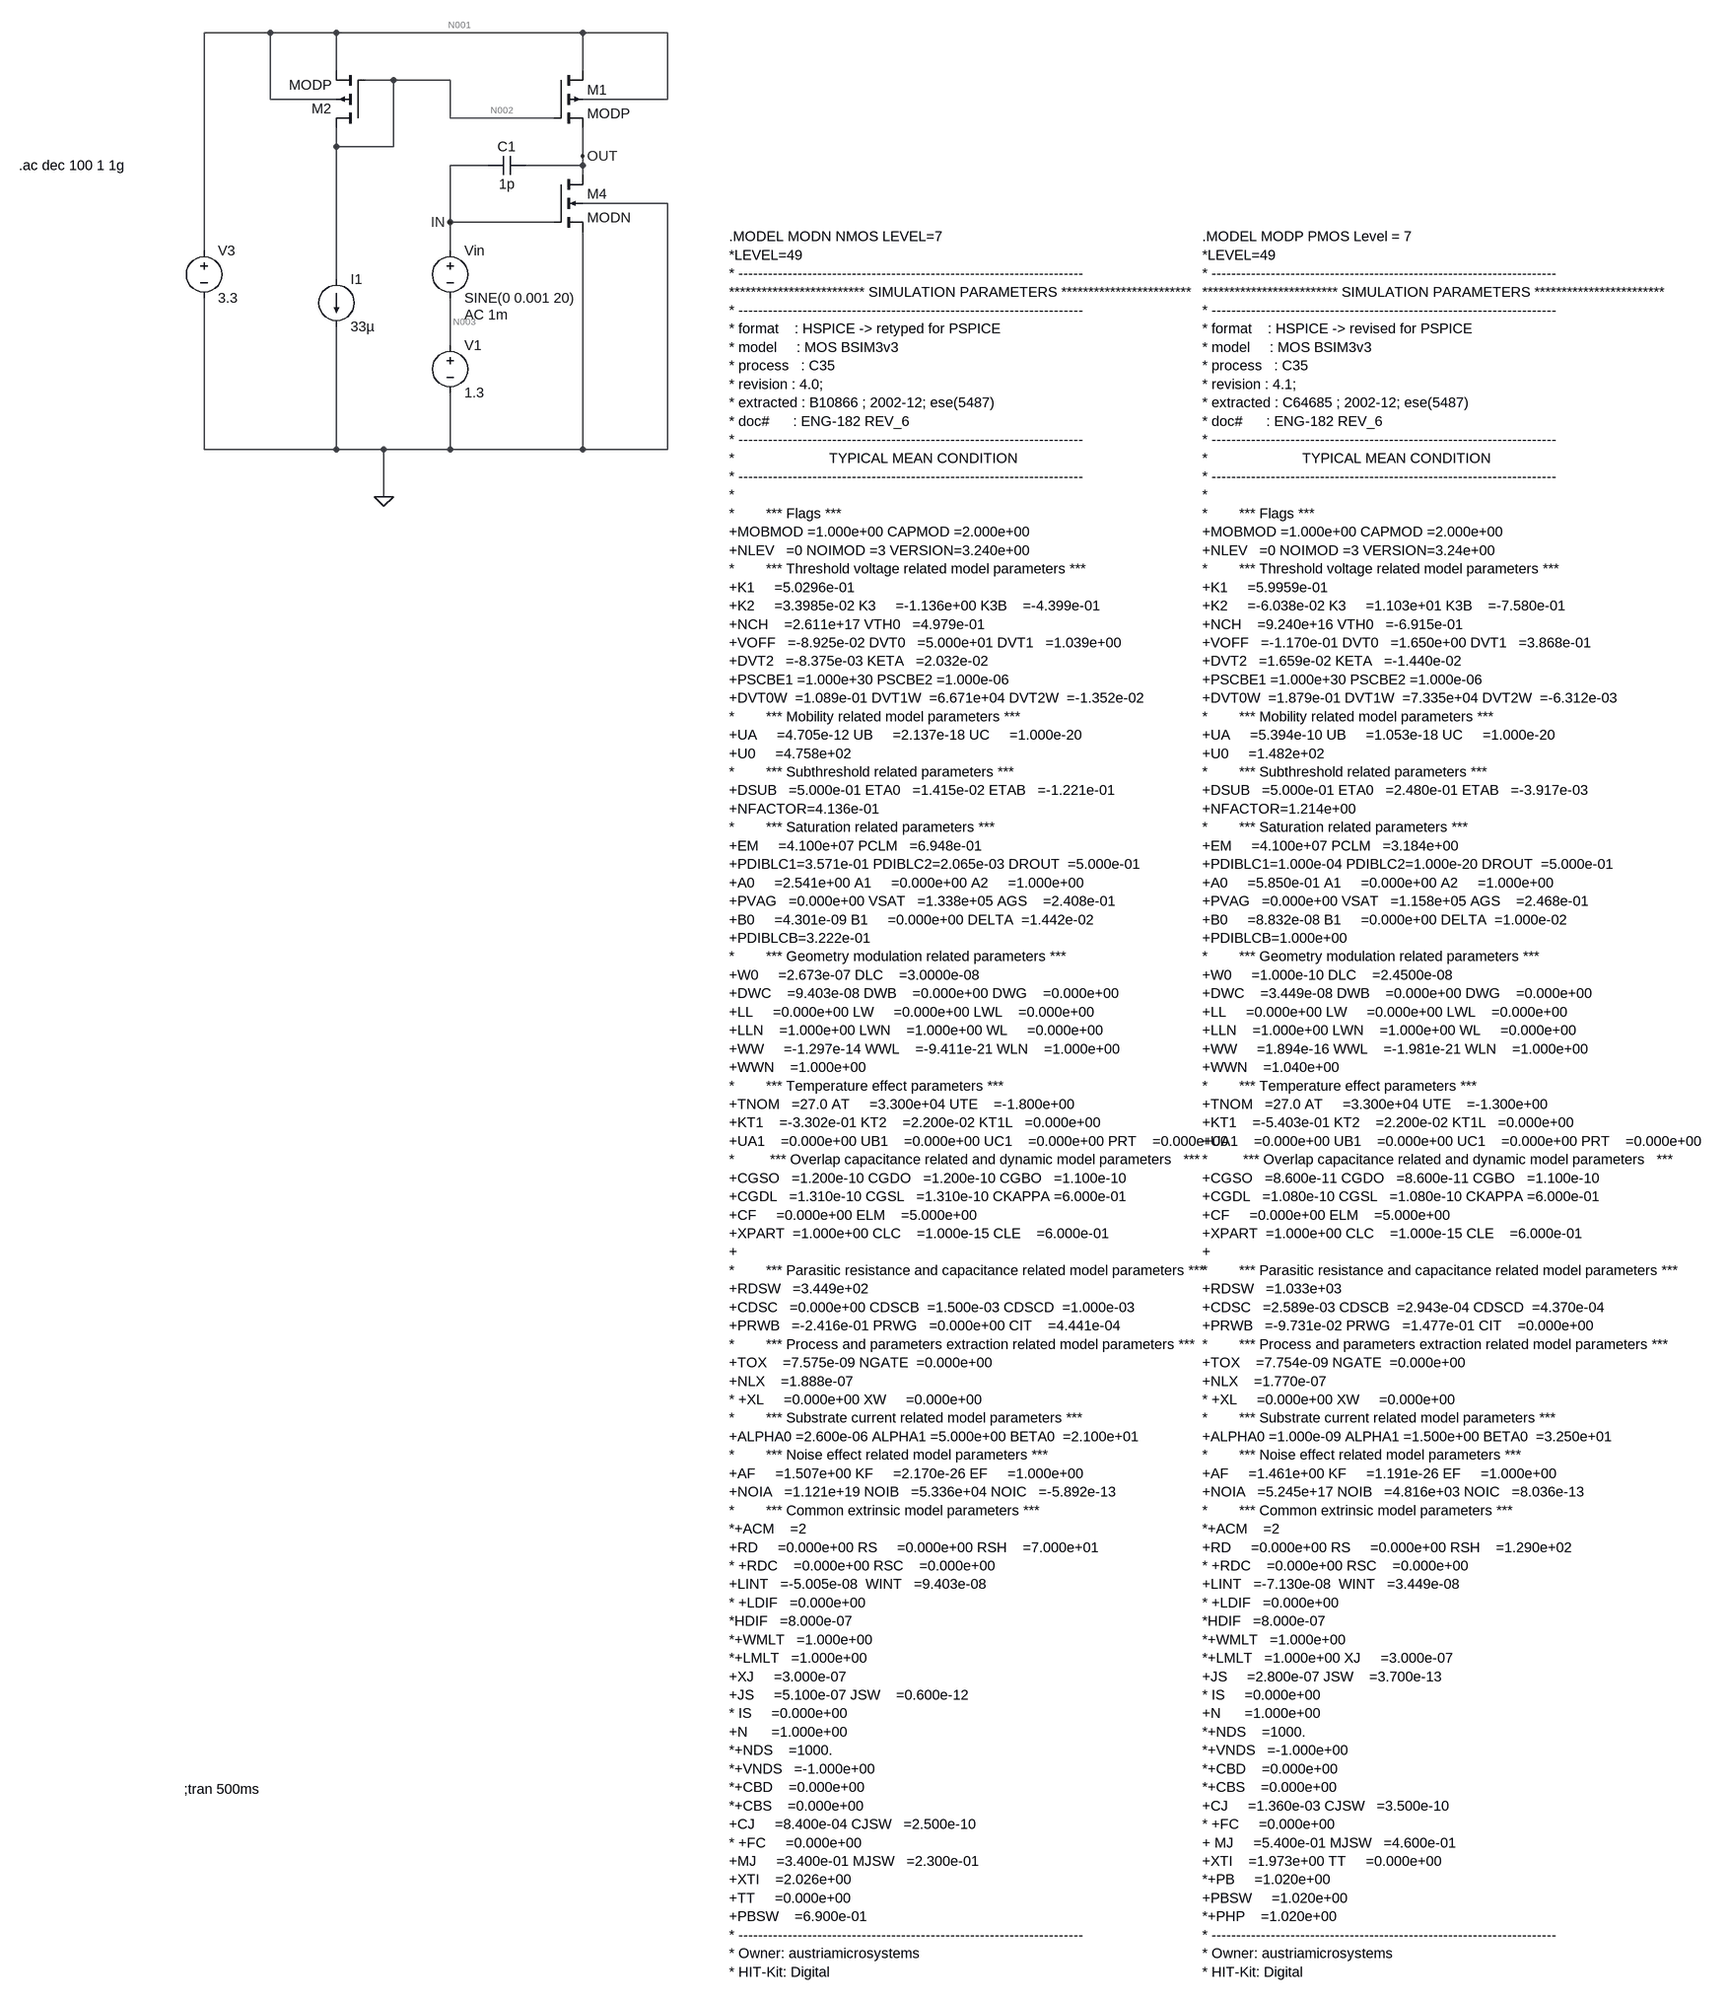
[diagram p0: schematic CS.asc]
CS.asc, the LTspice schematic file:
Version 4
SHEET 1 1960 2832
WIRE -464 -160 -576 -160
WIRE -352 -160 -464 -160
WIRE 64 -160 -352 -160
WIRE 208 -160 64 -160
WIRE -352 -96 -352 -160
WIRE 64 -96 64 -160
WIRE -256 -80 -304 -80
WIRE -160 -80 -256 -80
WIRE -464 -48 -464 -160
WIRE -352 -48 -464 -48
WIRE 208 -48 208 -160
WIRE 208 -48 64 -48
WIRE -160 -16 -160 -80
WIRE 16 -16 -160 -16
WIRE -352 32 -352 0
WIRE -256 32 -256 -80
WIRE -256 32 -352 32
WIRE 64 48 64 0
WIRE -96 64 -160 64
WIRE 64 64 64 48
WIRE 64 64 -32 64
WIRE 64 80 64 64
WIRE 208 128 64 128
WIRE -160 160 -160 64
WIRE 16 160 -160 160
WIRE -576 208 -576 -160
WIRE -160 208 -160 160
WIRE -352 256 -352 32
WIRE -160 368 -160 288
WIRE -576 544 -576 288
WIRE -352 544 -352 336
WIRE -352 544 -576 544
WIRE -272 544 -352 544
WIRE -160 544 -160 448
WIRE -160 544 -272 544
WIRE 64 544 64 176
WIRE 64 544 -160 544
WIRE 208 544 208 128
WIRE 208 544 64 544
WIRE -272 624 -272 544
FLAG -272 624 0
FLAG 64 48 OUT
FLAG -160 160 IN
SYMBOL voltage -160 352 R0
WINDOW 123 0 0 Left 2
WINDOW 39 0 0 Left 2
SYMATTR InstName V1
SYMATTR Value 1.3
SYMBOL voltage -160 192 R0
WINDOW 123 24 124 Left 2
WINDOW 39 0 0 Left 2
SYMATTR InstName Vin
SYMATTR Value SINE(0 0.001 20)
SYMATTR Value2 AC 1m
SYMBOL current -352 256 R0
WINDOW 123 0 0 Left 2
WINDOW 39 0 0 Left 2
SYMATTR InstName I1
SYMATTR Value 33µ
SYMBOL voltage -576 192 R0
WINDOW 123 0 0 Left 2
WINDOW 39 0 0 Left 2
SYMATTR InstName V3
SYMATTR Value 3.3
SYMBOL nmos4 16 80 R0
SYMATTR InstName M4
SYMATTR Value MODN
SYMATTR Value2 l=1.4u w=1.4u
SYMBOL pmos4 16 -96 R0
SYMATTR InstName M1
SYMATTR Value MODP
SYMATTR Value2 l=1.4u w=1.4u
SYMBOL pmos4 -304 0 R180
SYMATTR InstName M2
SYMATTR Value MODP
SYMATTR Value2 l=1.4u w=1.4u
SYMBOL cap -32 48 R90
WINDOW 0 0 32 VBottom 2
WINDOW 3 32 32 VTop 2
SYMATTR InstName C1
SYMATTR Value 1p
TEXT 312 184 Left 2 !.MODEL MODN NMOS LEVEL=7\n*LEVEL=49 \n* ----------------------------------------------------------------------\n************************* SIMULATION PARAMETERS ************************\n* ----------------------------------------------------------------------\n* format    : HSPICE -> retyped for PSPICE\n* model     : MOS BSIM3v3\n* process   : C35\n* revision : 4.0; \n* extracted : B10866 ; 2002-12; ese(5487)\n* doc#      : ENG-182 REV_6\n* ----------------------------------------------------------------------\n*                        TYPICAL MEAN CONDITION\n* ----------------------------------------------------------------------\n*\n*        *** Flags ***\n+MOBMOD =1.000e+00 CAPMOD =2.000e+00 \n+NLEV   =0 NOIMOD =3 VERSION=3.240e+00 \n*        *** Threshold voltage related model parameters ***\n+K1     =5.0296e-01 \n+K2     =3.3985e-02 K3     =-1.136e+00 K3B    =-4.399e-01 \n+NCH    =2.611e+17 VTH0   =4.979e-01 \n+VOFF   =-8.925e-02 DVT0   =5.000e+01 DVT1   =1.039e+00 \n+DVT2   =-8.375e-03 KETA   =2.032e-02 \n+PSCBE1 =1.000e+30 PSCBE2 =1.000e-06 \n+DVT0W  =1.089e-01 DVT1W  =6.671e+04 DVT2W  =-1.352e-02 \n*        *** Mobility related model parameters ***\n+UA     =4.705e-12 UB     =2.137e-18 UC     =1.000e-20 \n+U0     =4.758e+02 \n*        *** Subthreshold related parameters ***\n+DSUB   =5.000e-01 ETA0   =1.415e-02 ETAB   =-1.221e-01 \n+NFACTOR=4.136e-01 \n*        *** Saturation related parameters ***\n+EM     =4.100e+07 PCLM   =6.948e-01 \n+PDIBLC1=3.571e-01 PDIBLC2=2.065e-03 DROUT  =5.000e-01 \n+A0     =2.541e+00 A1     =0.000e+00 A2     =1.000e+00 \n+PVAG   =0.000e+00 VSAT   =1.338e+05 AGS    =2.408e-01 \n+B0     =4.301e-09 B1     =0.000e+00 DELTA  =1.442e-02 \n+PDIBLCB=3.222e-01 \n*        *** Geometry modulation related parameters ***\n+W0     =2.673e-07 DLC    =3.0000e-08 \n+DWC    =9.403e-08 DWB    =0.000e+00 DWG    =0.000e+00 \n+LL     =0.000e+00 LW     =0.000e+00 LWL    =0.000e+00 \n+LLN    =1.000e+00 LWN    =1.000e+00 WL     =0.000e+00 \n+WW     =-1.297e-14 WWL    =-9.411e-21 WLN    =1.000e+00 \n+WWN    =1.000e+00 \n*        *** Temperature effect parameters ***\n+TNOM   =27.0 AT     =3.300e+04 UTE    =-1.800e+00 \n+KT1    =-3.302e-01 KT2    =2.200e-02 KT1L   =0.000e+00 \n+UA1    =0.000e+00 UB1    =0.000e+00 UC1    =0.000e+00 PRT    =0.000e+00 \n*         *** Overlap capacitance related and dynamic model parameters   ***\n+CGSO   =1.200e-10 CGDO   =1.200e-10 CGBO   =1.100e-10 \n+CGDL   =1.310e-10 CGSL   =1.310e-10 CKAPPA =6.000e-01 \n+CF     =0.000e+00 ELM    =5.000e+00 \n+XPART  =1.000e+00 CLC    =1.000e-15 CLE    =6.000e-01 \n+\n*        *** Parasitic resistance and capacitance related model parameters ***\n+RDSW   =3.449e+02 \n+CDSC   =0.000e+00 CDSCB  =1.500e-03 CDSCD  =1.000e-03 \n+PRWB   =-2.416e-01 PRWG   =0.000e+00 CIT    =4.441e-04 \n*        *** Process and parameters extraction related model parameters ***\n+TOX    =7.575e-09 NGATE  =0.000e+00 \n+NLX    =1.888e-07 \n* +XL     =0.000e+00 XW     =0.000e+00 \n*        *** Substrate current related model parameters ***\n+ALPHA0 =2.600e-06 ALPHA1 =5.000e+00 BETA0  =2.100e+01 \n*        *** Noise effect related model parameters ***\n+AF     =1.507e+00 KF     =2.170e-26 EF     =1.000e+00 \n+NOIA   =1.121e+19 NOIB   =5.336e+04 NOIC   =-5.892e-13 \n*        *** Common extrinsic model parameters ***\n*+ACM    =2        \n+RD     =0.000e+00 RS     =0.000e+00 RSH    =7.000e+01 \n* +RDC    =0.000e+00 RSC    =0.000e+00 \n+LINT   =-5.005e-08  WINT   =9.403e-08 \n* +LDIF   =0.000e+00 \n*HDIF   =8.000e-07\n*+WMLT   =1.000e+00 \n*+LMLT   =1.000e+00 \n+XJ     =3.000e-07 \n+JS     =5.100e-07 JSW    =0.600e-12 \n* IS     =0.000e+00 \n+N      =1.000e+00 \n*+NDS    =1000. \n*+VNDS   =-1.000e+00 \n*+CBD    =0.000e+00 \n*+CBS    =0.000e+00 \n+CJ     =8.400e-04 CJSW   =2.500e-10 \n* +FC     =0.000e+00 \n+MJ     =3.400e-01 MJSW   =2.300e-01 \n+XTI    =2.026e+00 \n+TT     =0.000e+00 \n+PBSW    =6.900e-01 \n* ----------------------------------------------------------------------\n* Owner: austriamicrosystems\n* HIT-Kit: Digital
TEXT 1112 184 Left 2 !.MODEL MODP PMOS Level = 7\n*LEVEL=49 \n* ----------------------------------------------------------------------\n************************* SIMULATION PARAMETERS ************************\n* ----------------------------------------------------------------------\n* format    : HSPICE -> revised for PSPICE\n* model     : MOS BSIM3v3\n* process   : C35\n* revision : 4.1; \n* extracted : C64685 ; 2002-12; ese(5487)\n* doc#      : ENG-182 REV_6\n* ----------------------------------------------------------------------\n*                        TYPICAL MEAN CONDITION\n* ----------------------------------------------------------------------\n*\n*        *** Flags ***\n+MOBMOD =1.000e+00 CAPMOD =2.000e+00 \n+NLEV   =0 NOIMOD =3 VERSION=3.24e+00 \n*        *** Threshold voltage related model parameters ***\n+K1     =5.9959e-01 \n+K2     =-6.038e-02 K3     =1.103e+01 K3B    =-7.580e-01 \n+NCH    =9.240e+16 VTH0   =-6.915e-01 \n+VOFF   =-1.170e-01 DVT0   =1.650e+00 DVT1   =3.868e-01 \n+DVT2   =1.659e-02 KETA   =-1.440e-02 \n+PSCBE1 =1.000e+30 PSCBE2 =1.000e-06 \n+DVT0W  =1.879e-01 DVT1W  =7.335e+04 DVT2W  =-6.312e-03 \n*        *** Mobility related model parameters ***\n+UA     =5.394e-10 UB     =1.053e-18 UC     =1.000e-20 \n+U0     =1.482e+02 \n*        *** Subthreshold related parameters ***\n+DSUB   =5.000e-01 ETA0   =2.480e-01 ETAB   =-3.917e-03 \n+NFACTOR=1.214e+00 \n*        *** Saturation related parameters ***\n+EM     =4.100e+07 PCLM   =3.184e+00 \n+PDIBLC1=1.000e-04 PDIBLC2=1.000e-20 DROUT  =5.000e-01 \n+A0     =5.850e-01 A1     =0.000e+00 A2     =1.000e+00 \n+PVAG   =0.000e+00 VSAT   =1.158e+05 AGS    =2.468e-01 \n+B0     =8.832e-08 B1     =0.000e+00 DELTA  =1.000e-02 \n+PDIBLCB=1.000e+00 \n*        *** Geometry modulation related parameters ***\n+W0     =1.000e-10 DLC    =2.4500e-08 \n+DWC    =3.449e-08 DWB    =0.000e+00 DWG    =0.000e+00 \n+LL     =0.000e+00 LW     =0.000e+00 LWL    =0.000e+00 \n+LLN    =1.000e+00 LWN    =1.000e+00 WL     =0.000e+00 \n+WW     =1.894e-16 WWL    =-1.981e-21 WLN    =1.000e+00 \n+WWN    =1.040e+00 \n*        *** Temperature effect parameters ***\n+TNOM   =27.0 AT     =3.300e+04 UTE    =-1.300e+00 \n+KT1    =-5.403e-01 KT2    =2.200e-02 KT1L   =0.000e+00 \n+UA1    =0.000e+00 UB1    =0.000e+00 UC1    =0.000e+00 PRT    =0.000e+00 \n*         *** Overlap capacitance related and dynamic model parameters   ***\n+CGSO   =8.600e-11 CGDO   =8.600e-11 CGBO   =1.100e-10 \n+CGDL   =1.080e-10 CGSL   =1.080e-10 CKAPPA =6.000e-01 \n+CF     =0.000e+00 ELM    =5.000e+00 \n+XPART  =1.000e+00 CLC    =1.000e-15 CLE    =6.000e-01 \n+\n*        *** Parasitic resistance and capacitance related model parameters ***\n+RDSW   =1.033e+03 \n+CDSC   =2.589e-03 CDSCB  =2.943e-04 CDSCD  =4.370e-04 \n+PRWB   =-9.731e-02 PRWG   =1.477e-01 CIT    =0.000e+00 \n*        *** Process and parameters extraction related model parameters ***\n+TOX    =7.754e-09 NGATE  =0.000e+00 \n+NLX    =1.770e-07 \n* +XL     =0.000e+00 XW     =0.000e+00 \n*        *** Substrate current related model parameters ***\n+ALPHA0 =1.000e-09 ALPHA1 =1.500e+00 BETA0  =3.250e+01 \n*        *** Noise effect related model parameters ***\n+AF     =1.461e+00 KF     =1.191e-26 EF     =1.000e+00 \n+NOIA   =5.245e+17 NOIB   =4.816e+03 NOIC   =8.036e-13 \n*        *** Common extrinsic model parameters ***\n*+ACM    =2        \n+RD     =0.000e+00 RS     =0.000e+00 RSH    =1.290e+02 \n* +RDC    =0.000e+00 RSC    =0.000e+00 \n+LINT   =-7.130e-08  WINT   =3.449e-08 \n* +LDIF   =0.000e+00\n*HDIF   =8.000e-07 \n*+WMLT   =1.000e+00 \n*+LMLT   =1.000e+00 XJ     =3.000e-07 \n+JS     =2.800e-07 JSW    =3.700e-13 \n* IS     =0.000e+00 \n+N      =1.000e+00 \n*+NDS    =1000. \n*+VNDS   =-1.000e+00 \n*+CBD    =0.000e+00 \n*+CBS    =0.000e+00 \n+CJ     =1.360e-03 CJSW   =3.500e-10 \n* +FC     =0.000e+00 \n+ MJ     =5.400e-01 MJSW   =4.600e-01 \n+XTI    =1.973e+00 TT     =0.000e+00 \n*+PB     =1.020e+00 \n+PBSW     =1.020e+00\n*+PHP    =1.020e+00 \n* ----------------------------------------------------------------------\n* Owner: austriamicrosystems\n* HIT-Kit: Digital
TEXT -610 2808 Left 2 !;tran 500ms
TEXT -984 64 Left 2 !.ac dec 100 1 1g

The netlist it stands for:
* CS.asc
V1 N003 0 1.3
Vin IN N003 SINE(0 0.001 20) AC 1m
I1 N002 0 33µ
V3 N001 0 3.3
M4 OUT IN 0 0 MODN l=1.4u w=1.4u
M1 N001 N002 OUT N001 MODP l=1.4u w=1.4u
M2 N002 N002 N001 N001 MODP l=1.4u w=1.4u
C1 OUT IN 1p
.model NMOS NMOS
.model PMOS PMOS
.lib standard.mos
.MODEL MODN NMOS LEVEL=7
*LEVEL=49
* ----------------------------------------------------------------------
************************* SIMULATION PARAMETERS ************************
* ----------------------------------------------------------------------
* format    : HSPICE -> retyped for PSPICE
* model     : MOS BSIM3v3
* process   : C35
* revision : 4.0;
* extracted : B10866 ; 2002-12; ese(5487)
* doc#      : ENG-182 REV_6
* ----------------------------------------------------------------------
*                        TYPICAL MEAN CONDITION
* ----------------------------------------------------------------------
*
*        *** Flags ***
+MOBMOD =1.000e+00 CAPMOD =2.000e+00
+NLEV   =0 NOIMOD =3 VERSION=3.240e+00
*        *** Threshold voltage related model parameters ***
+K1     =5.0296e-01
+K2     =3.3985e-02 K3     =-1.136e+00 K3B    =-4.399e-01
+NCH    =2.611e+17 VTH0   =4.979e-01
+VOFF   =-8.925e-02 DVT0   =5.000e+01 DVT1   =1.039e+00
+DVT2   =-8.375e-03 KETA   =2.032e-02
+PSCBE1 =1.000e+30 PSCBE2 =1.000e-06
+DVT0W  =1.089e-01 DVT1W  =6.671e+04 DVT2W  =-1.352e-02
*        *** Mobility related model parameters ***
+UA     =4.705e-12 UB     =2.137e-18 UC     =1.000e-20
+U0     =4.758e+02
*        *** Subthreshold related parameters ***
+DSUB   =5.000e-01 ETA0   =1.415e-02 ETAB   =-1.221e-01
+NFACTOR=4.136e-01
*        *** Saturation related parameters ***
+EM     =4.100e+07 PCLM   =6.948e-01
+PDIBLC1=3.571e-01 PDIBLC2=2.065e-03 DROUT  =5.000e-01
+A0     =2.541e+00 A1     =0.000e+00 A2     =1.000e+00
+PVAG   =0.000e+00 VSAT   =1.338e+05 AGS    =2.408e-01
+B0     =4.301e-09 B1     =0.000e+00 DELTA  =1.442e-02
+PDIBLCB=3.222e-01
*        *** Geometry modulation related parameters ***
+W0     =2.673e-07 DLC    =3.0000e-08
+DWC    =9.403e-08 DWB    =0.000e+00 DWG    =0.000e+00
+LL     =0.000e+00 LW     =0.000e+00 LWL    =0.000e+00
+LLN    =1.000e+00 LWN    =1.000e+00 WL     =0.000e+00
+WW     =-1.297e-14 WWL    =-9.411e-21 WLN    =1.000e+00
+WWN    =1.000e+00
*        *** Temperature effect parameters ***
+TNOM   =27.0 AT     =3.300e+04 UTE    =-1.800e+00
+KT1    =-3.302e-01 KT2    =2.200e-02 KT1L   =0.000e+00
+UA1    =0.000e+00 UB1    =0.000e+00 UC1    =0.000e+00 PRT    =0.000e+00
*         *** Overlap capacitance related and dynamic model parameters   ***
+CGSO   =1.200e-10 CGDO   =1.200e-10 CGBO   =1.100e-10
+CGDL   =1.310e-10 CGSL   =1.310e-10 CKAPPA =6.000e-01
+CF     =0.000e+00 ELM    =5.000e+00
+XPART  =1.000e+00 CLC    =1.000e-15 CLE    =6.000e-01
+
*        *** Parasitic resistance and capacitance related model parameters ***
+RDSW   =3.449e+02
+CDSC   =0.000e+00 CDSCB  =1.500e-03 CDSCD  =1.000e-03
+PRWB   =-2.416e-01 PRWG   =0.000e+00 CIT    =4.441e-04
*        *** Process and parameters extraction related model parameters ***
+TOX    =7.575e-09 NGATE  =0.000e+00
+NLX    =1.888e-07
* +XL     =0.000e+00 XW     =0.000e+00
*        *** Substrate current related model parameters ***
+ALPHA0 =2.600e-06 ALPHA1 =5.000e+00 BETA0  =2.100e+01
*        *** Noise effect related model parameters ***
+AF     =1.507e+00 KF     =2.170e-26 EF     =1.000e+00
+NOIA   =1.121e+19 NOIB   =5.336e+04 NOIC   =-5.892e-13
*        *** Common extrinsic model parameters ***
*+ACM    =2
+RD     =0.000e+00 RS     =0.000e+00 RSH    =7.000e+01
* +RDC    =0.000e+00 RSC    =0.000e+00
+LINT   =-5.005e-08  WINT   =9.403e-08
* +LDIF   =0.000e+00
*HDIF   =8.000e-07
*+WMLT   =1.000e+00
*+LMLT   =1.000e+00
+XJ     =3.000e-07
+JS     =5.100e-07 JSW    =0.600e-12
* IS     =0.000e+00
+N      =1.000e+00
*+NDS    =1000.
*+VNDS   =-1.000e+00
*+CBD    =0.000e+00
*+CBS    =0.000e+00
+CJ     =8.400e-04 CJSW   =2.500e-10
* +FC     =0.000e+00
+MJ     =3.400e-01 MJSW   =2.300e-01
+XTI    =2.026e+00
+TT     =0.000e+00
+PBSW    =6.900e-01
* ----------------------------------------------------------------------
* Owner: austriamicrosystems
* HIT-Kit: Digital
.MODEL MODP PMOS Level = 7
*LEVEL=49
* ----------------------------------------------------------------------
************************* SIMULATION PARAMETERS ************************
* ----------------------------------------------------------------------
* format    : HSPICE -> revised for PSPICE
* model     : MOS BSIM3v3
* process   : C35
* revision : 4.1;
* extracted : C64685 ; 2002-12; ese(5487)
* doc#      : ENG-182 REV_6
* ----------------------------------------------------------------------
*                        TYPICAL MEAN CONDITION
* ----------------------------------------------------------------------
*
*        *** Flags ***
+MOBMOD =1.000e+00 CAPMOD =2.000e+00
+NLEV   =0 NOIMOD =3 VERSION=3.24e+00
*        *** Threshold voltage related model parameters ***
+K1     =5.9959e-01
+K2     =-6.038e-02 K3     =1.103e+01 K3B    =-7.580e-01
+NCH    =9.240e+16 VTH0   =-6.915e-01
+VOFF   =-1.170e-01 DVT0   =1.650e+00 DVT1   =3.868e-01
+DVT2   =1.659e-02 KETA   =-1.440e-02
+PSCBE1 =1.000e+30 PSCBE2 =1.000e-06
+DVT0W  =1.879e-01 DVT1W  =7.335e+04 DVT2W  =-6.312e-03
*        *** Mobility related model parameters ***
+UA     =5.394e-10 UB     =1.053e-18 UC     =1.000e-20
+U0     =1.482e+02
*        *** Subthreshold related parameters ***
+DSUB   =5.000e-01 ETA0   =2.480e-01 ETAB   =-3.917e-03
+NFACTOR=1.214e+00
*        *** Saturation related parameters ***
+EM     =4.100e+07 PCLM   =3.184e+00
+PDIBLC1=1.000e-04 PDIBLC2=1.000e-20 DROUT  =5.000e-01
+A0     =5.850e-01 A1     =0.000e+00 A2     =1.000e+00
+PVAG   =0.000e+00 VSAT   =1.158e+05 AGS    =2.468e-01
+B0     =8.832e-08 B1     =0.000e+00 DELTA  =1.000e-02
+PDIBLCB=1.000e+00
*        *** Geometry modulation related parameters ***
+W0     =1.000e-10 DLC    =2.4500e-08
+DWC    =3.449e-08 DWB    =0.000e+00 DWG    =0.000e+00
+LL     =0.000e+00 LW     =0.000e+00 LWL    =0.000e+00
+LLN    =1.000e+00 LWN    =1.000e+00 WL     =0.000e+00
+WW     =1.894e-16 WWL    =-1.981e-21 WLN    =1.000e+00
+WWN    =1.040e+00
*        *** Temperature effect parameters ***
+TNOM   =27.0 AT     =3.300e+04 UTE    =-1.300e+00
+KT1    =-5.403e-01 KT2    =2.200e-02 KT1L   =0.000e+00
+UA1    =0.000e+00 UB1    =0.000e+00 UC1    =0.000e+00 PRT    =0.000e+00
*         *** Overlap capacitance related and dynamic model parameters   ***
+CGSO   =8.600e-11 CGDO   =8.600e-11 CGBO   =1.100e-10
+CGDL   =1.080e-10 CGSL   =1.080e-10 CKAPPA =6.000e-01
+CF     =0.000e+00 ELM    =5.000e+00
+XPART  =1.000e+00 CLC    =1.000e-15 CLE    =6.000e-01
+
*        *** Parasitic resistance and capacitance related model parameters ***
+RDSW   =1.033e+03
+CDSC   =2.589e-03 CDSCB  =2.943e-04 CDSCD  =4.370e-04
+PRWB   =-9.731e-02 PRWG   =1.477e-01 CIT    =0.000e+00
*        *** Process and parameters extraction related model parameters ***
+TOX    =7.754e-09 NGATE  =0.000e+00
+NLX    =1.770e-07
* +XL     =0.000e+00 XW     =0.000e+00
*        *** Substrate current related model parameters ***
+ALPHA0 =1.000e-09 ALPHA1 =1.500e+00 BETA0  =3.250e+01
*        *** Noise effect related model parameters ***
+AF     =1.461e+00 KF     =1.191e-26 EF     =1.000e+00
+NOIA   =5.245e+17 NOIB   =4.816e+03 NOIC   =8.036e-13
*        *** Common extrinsic model parameters ***
*+ACM    =2
+RD     =0.000e+00 RS     =0.000e+00 RSH    =1.290e+02
* +RDC    =0.000e+00 RSC    =0.000e+00
+LINT   =-7.130e-08  WINT   =3.449e-08
* +LDIF   =0.000e+00
*HDIF   =8.000e-07
*+WMLT   =1.000e+00
*+LMLT   =1.000e+00 XJ     =3.000e-07
+JS     =2.800e-07 JSW    =3.700e-13
* IS     =0.000e+00
+N      =1.000e+00
*+NDS    =1000.
*+VNDS   =-1.000e+00
*+CBD    =0.000e+00
*+CBS    =0.000e+00
+CJ     =1.360e-03 CJSW   =3.500e-10
* +FC     =0.000e+00
+ MJ     =5.400e-01 MJSW   =4.600e-01
+XTI    =1.973e+00 TT     =0.000e+00
*+PB     =1.020e+00
+PBSW     =1.020e+00
*+PHP    =1.020e+00
* ----------------------------------------------------------------------
* Owner: austriamicrosystems
* HIT-Kit: Digital
;tran 500ms
.ac dec 100 1 1g
.backanno
.end

* Results of the author's LTspice run, read from the files saved beside the schematic
* Operating Point, zero values left out:
*   V(n003) = 1.3 V
*   V(in) = 1.3 V
*   V(n002) = 1.209 V
*   V(n001) = 3.3 V
*   V(out) = 1.168 V
*   Id(M2) = -33 µA
*   Ib(M2) = 2.101 pA
*   Is(M2) = 33 µA
*   Id(M1) = 33.03 µA
*   Ib(M1) = 2.142 pA
*   Is(M1) = -33.03 µA
*   Id(M4) = 33.03 µA
*   Ib(M4) = -1.178 pA
*   Is(M4) = -33.03 µA
*   I(I1) = 33 µA
*   I(V3) = -66.03 µA
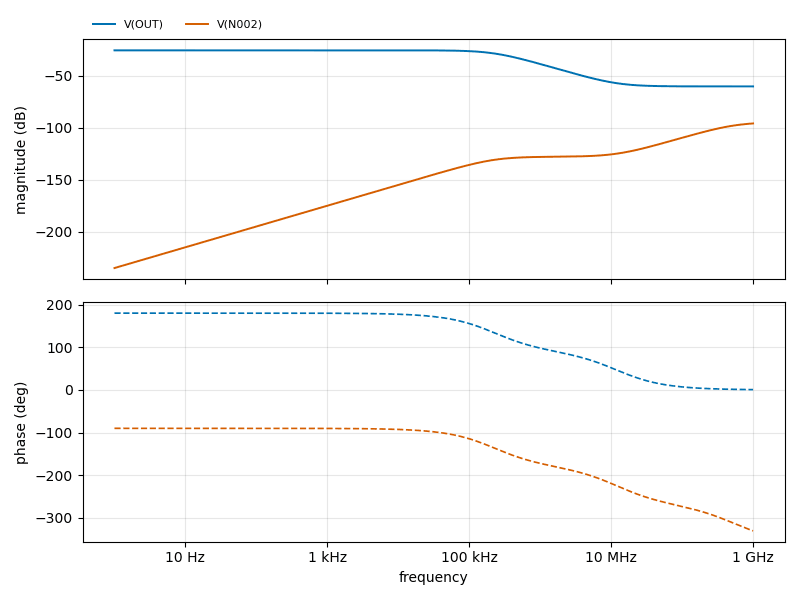
[diagram p1: AC Analysis of CS.asc, plotted from the saved traces]
* AC Analysis, 1 run:
*   V(OUT): -25.32 dB at 1 Hz, -60.00 dB at 1 GHz, peak -25.32 dB at 1 Hz, 3 dB below the peak at 225 kHz
*   V(N002): -234.66 dB at 1 Hz, -95.61 dB at 1 GHz, peak -95.61 dB at 1 GHz, 3 dB below the peak at 436.8 MHz